# Altium schematic sheet SENSOR.SchDoc: OCULUS RIFT DEVELOPMENT KIT 2 (DK2) MAIN BOARD
size B; Date: 12 MAR 2014; Author: L. BAINBRIDGE; CompanyName: Oculus VR, Inc.; DrawnBy: L. BAINBRIDGE; Engineer: L. BAINBRIDGE; Organization: Oculus VR, Inc.; DocumentNumber: 4; Revision: 3.3; SheetNumber: 4; SheetTotal: 6; PageSetup: Record=PageOptions|CenterHorizontal=True|CenterVertical=True|PrintScale=1.12|XCorrection=1.00|YCorrection=1.00|PrintKind=1|BorderSize=5000000|LeftOffset=0|BottomOffset=0|Orientation=2|PaperLength=1000|PaperWidth=1000|Scale=100|PaperSource=15|PrintQuality=1200|MediaType=1|DitherType=0|PaperKind=11 x 17|PrintScaleMode=1; SheetDescription: 3-AXIS GYROSCOPE, ACCELEROMETER AND MAGNETOMETER; PartNumber: N/A; ProjectName: DK2
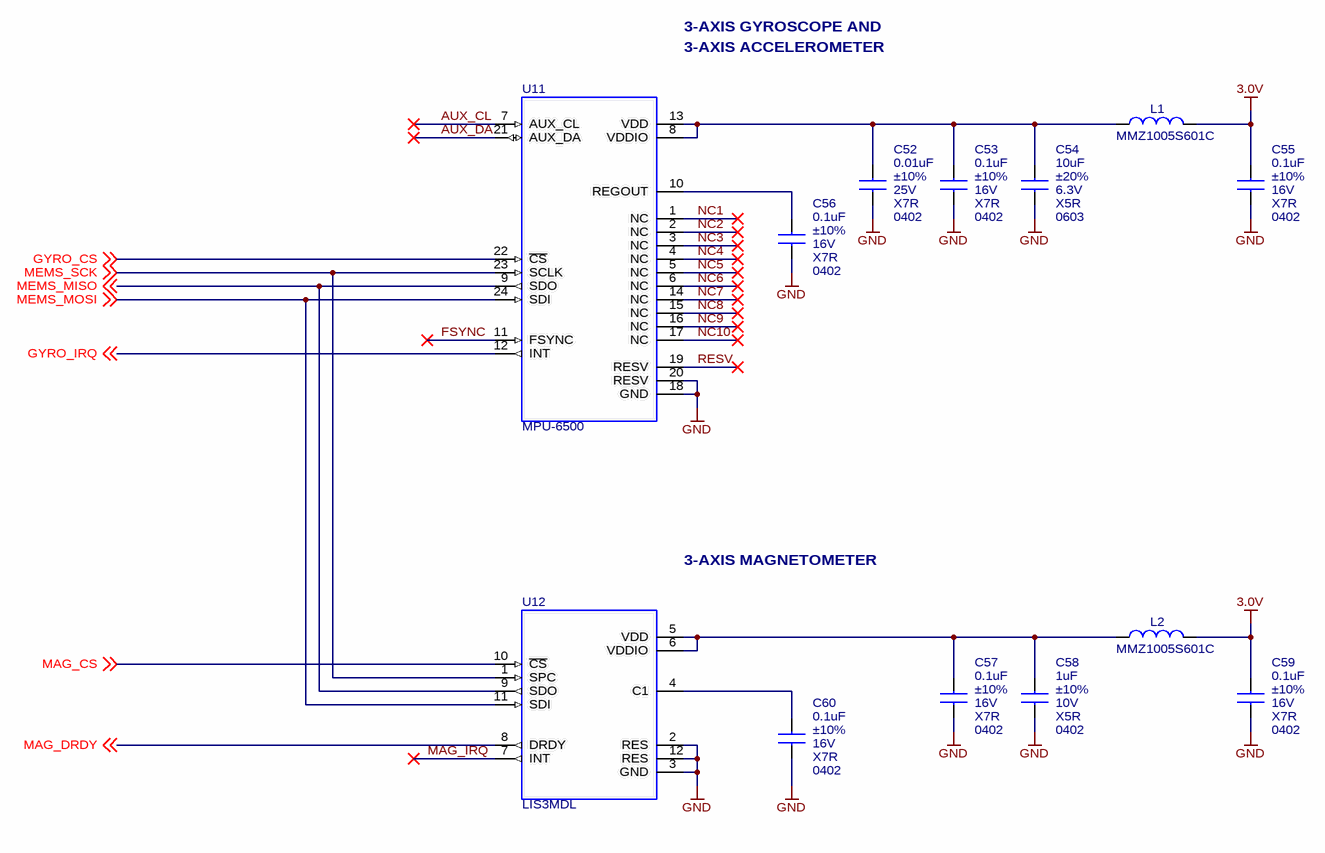
[diagram p0: SENSOR.SchDoc]

## Parts
C52  0.01uF  Tolerance: ±10%  Voltage: 25V  Dielectric: X7R  Package: 0402  [CAP_CERAMIC_0402]
C53  0.1uF  Tolerance: ±10%  Voltage: 16V  Dielectric: X7R  Package: 0402  [CAP_CERAMIC_0402]
C54  10uF  Tolerance: ±20%  Voltage: 6.3V  Dielectric: X5R  Package: 0603  [CAP_CERAMIC_0603]
C55  0.1uF  Tolerance: ±10%  Voltage: 16V  Dielectric: X7R  Package: 0402  [CAP_CERAMIC_0402]
C56  0.1uF  Tolerance: ±10%  Voltage: 16V  Dielectric: X7R  Package: 0402  [CAP_CERAMIC_0402]
C57  0.1uF  Tolerance: ±10%  Voltage: 16V  Dielectric: X7R  Package: 0402  [CAP_CERAMIC_0402]
C58  1uF  Tolerance: ±10%  Voltage: 10V  Dielectric: X5R  Package: 0402  [CAP_CERAMIC_0402]
C59  0.1uF  Tolerance: ±10%  Voltage: 16V  Dielectric: X7R  Package: 0402  [CAP_CERAMIC_0402]
C60  0.1uF  Tolerance: ±10%  Voltage: 16V  Dielectric: X7R  Package: 0402  [CAP_CERAMIC_0402]
L1  MMZ1005S601C  [INDUCTOR_0402]
L2  MMZ1005S601C  [INDUCTOR_0402]
U11  MPU-6500  [QFN-24]
U12  LIS3MDL  [LGA-12]

## Nets
3.0V: C55.1 C59.1 L1.2 L2.2
GND: C52.2 C53.2 C54.2 C55.2 C56.2 C57.2 C58.2 C59.2 C60.2 U11.18(GND) U11.20(RESV) U12.2(RES) U12.3(GND) U12.12(RES)
AUX_CL: U11.7(AUX_CL)
AUX_DA: U11.21(AUX_DA)
FSYNC: U11.11(FSYNC)
GYRO_CS: U11.22(~{CS}) ; off-sheet GYRO_CS
GYRO_IRQ: U11.12(INT) ; off-sheet GYRO_IRQ
MAG_CS: U12.10(~{CS}) ; off-sheet MAG_CS
MAG_DRDY: U12.8(DRDY) ; off-sheet MAG_DRDY
MAG_IRQ: U12.7(INT)
MEMS_MISO: U11.9(SDO) U12.9(SDO) ; off-sheet MEMS_MISO
MEMS_MOSI: U11.24(SDI) U12.11(SDI) ; off-sheet MEMS_MOSI
MEMS_SCK: U11.23(SCLK) U12.1(SPC) ; off-sheet MEMS_SCK
NC1: U11.1(NC)
NC2: U11.2(NC)
NC3: U11.3(NC)
NC4: U11.4(NC)
NC5: U11.5(NC)
NC6: U11.6(NC)
NC7: U11.14(NC)
NC8: U11.15(NC)
NC9: U11.16(NC)
NC10: U11.17(NC)
RESV: U11.19(RESV)
NetC52_1: C52.1 C53.1 C54.1 L1.1 U11.8(VDDIO) U11.13(VDD)
NetC56_1: C56.1 U11.10(REGOUT)
NetC57_1: C57.1 C58.1 L2.1 U12.5(VDD) U12.6(VDDIO)
NetC60_1: C60.1 U12.4(C1)

## Notes on the sheet
- 3-AXIS GYROSCOPE AND
- 3-AXIS ACCELEROMETER
- 3-AXIS MAGNETOMETER
- TITLE
- ENGINEER
- APPROVED
- DATE
- THIS DOCUMENT IS CONFIDENTIAL AND CONTAINS DESIGNS AND OTHER INFORMATION WHICH ARE THE PROPERTY OF OCULUS VR, INC. AND MAY NOT, IN WHOLE OR IN PART, BE DUPLICATED OR DISCLOSED OR USED FOR THE MANUFACTURE OF THE PART DISCLOSED HEREIN OR FOR ANY OTHER PURPOSE WITHOUT THE PRIOR WRITTEN PERMISSION OF OCULUS VR, INC.
- SHEET DESCRIPTION
- SIZE
- PART NUMBER
- REVISION
- SHEET
- of
- B

## Library data of the parts
C52 = CAP, CERAMIC: CAP, CERAMIC, 0.01uF, ±10%, 25V, X7R, 0402; Manufacturer: MURATA ELECTRONICS; Part Number: GRM155R71E103KA01D
C53 C55-C57 C59 C60 = CAP, CERAMIC: CAP, CERAMIC, 0.1uF, ±10%, 16V, X7R, 0402; Manufacturer: MURATA ELECTRONICS; Part Number: GRM155R71C104KA88D
C54 = CAP, CERAMIC: CAP, CERAMIC, 10uF, ±20%, 6.3V, X5R, 0603; Manufacturer: MURATA ELECTRONICS; Part Number: GRM188R60J106ME47D
C58 = CAP, CERAMIC: CAP, CERAMIC, 1uF, ±10%, 10V, X5R, 0402; Manufacturer: MURATA ELECTRONICS; Part Number: GRM155R61A105KE15D
L1 L2 = INDUCTOR: FERRITE CHIP BEAD, 600 OHM @ 100MHz, 300mA, 0402; Manufacturer: TDK CORPORATION; Part Number: MMZ1005S601C; Package: 0402
U11 = MPU-6500: IC, MEMS 3 AXIS GYROSCOPE AND 3 AXIS ACCELEROMETER; Manufacturer: INVENSENSE; Part Number: MPU-6500; Verified Pinout: *; Updated: *
U12 = LIS3MDL: IC, MEMS 3 AXIS MAGNETOMETER; Manufacturer: STMICROELECTRONICS; Part Number: LIS3MDLTR; Verified Pinout: *